# Altium project Sub Board Top.PrjPcb
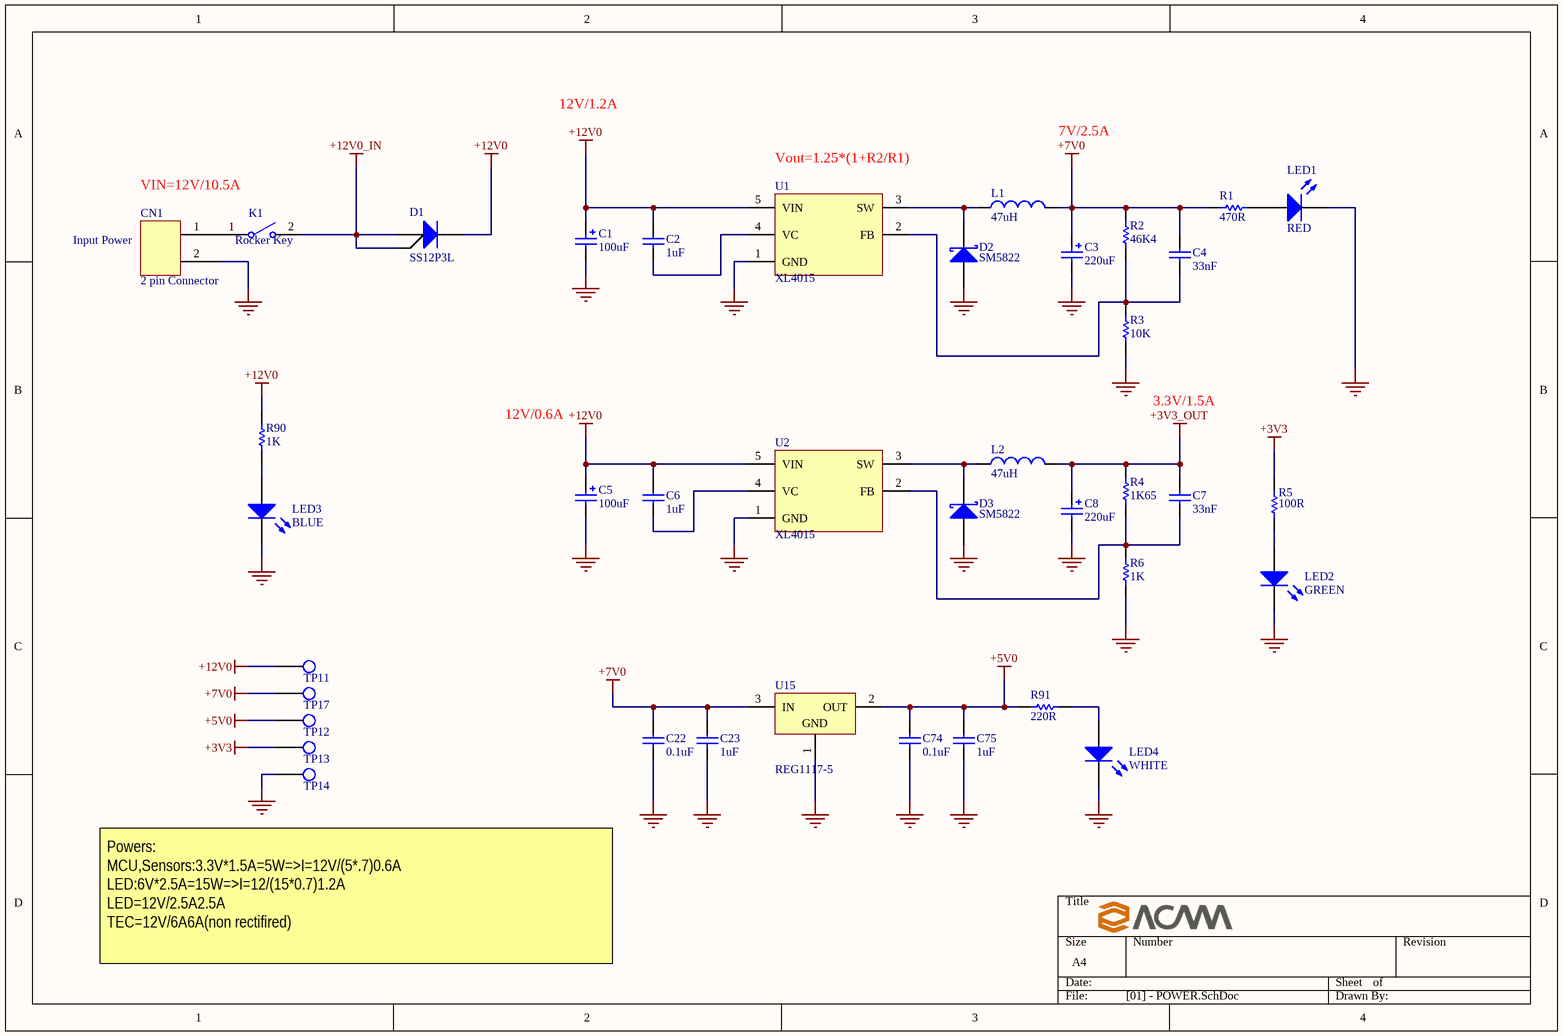
[diagram p0: [01] - POWER.SchDoc]
7 sheets, 117 parts. Net scope: flat (ports and power ports of the same name join across sheets).
Board file: Top Board_PCB.PcbDoc
Sheets:
  [01] - POWER.SchDoc
  [03] - RS232, JOYSTICK.SchDoc
  [06] - TEMP, HUM, CUR SENSORS.SchDoc
  [07] - TEMP, PROXIMITY SENSORS.SchDoc
  [08] - LUX, LED_BOARD CONN.SchDoc
  [09] - DISPLAY.SchDoc
  [13] - TOP BOARD HEADER.SchDoc

## Sheet [01] - POWER.SchDoc
size A4; DocumentNumber: 1; SheetNumber: 1; SheetTotal: 14

### Parts
C1  100uF  [WCAP-ASLI_6.3x5.5]
C2  1uF  [0805_C_AUTO]
C3  220uF  [WCAP-ASLI_6.3x5.5]
C4  33nF  [0805_C_AUTO]
C5  100uF  [WCAP-ASLI_6.3x5.5]
C6  1uF  [0805_C_AUTO]
C7  33nF  [0805_C_AUTO]
C8  220uF  [WCAP-ASLI_6.3x5.5]
C22  0.1uF  [0805_C_AUTO]
C23  1uF  [0805_C_AUTO]
C74  0.1uF  [0805_C_AUTO]
C75  1uF  [0805_C_AUTO]
CN1  2 pin Connector  [KF142R_CONN_2PIN]
D1  SS12P3L  [TO-277A]
D2  SM5822  [DO-214AB]
D3  SM5822  [DO-214AB]
K1  Rocker Key  [MR-1-116]
L1  47uH  [INDUCTOR_12x12]
L2  47uH  [INDUCTOR_12x12]
LED1  RED  [LED_1206]
LED2  GREEN  [LED_1206]
LED3  BLUE  [LED_1206]
LED4  WHITE  [LED_1206]
R1  470R  [0805_R_AUTO]
R2  46K4  [0805_R_AUTO]
R3  10K  [0805_R_AUTO]
R4  1K65  [0805_R_AUTO]
R5  100R  [0805_R_AUTO]
R6  1K  [0805_R_AUTO]
R90  1K  [0805_R_AUTO]
R91  220R  [0805_R_AUTO]
TP11  Test Point  [PIN_2mm]  (value not drawn)
TP12  Test Point  [PIN_2mm]  (value not drawn)
TP13  Test Point  [PIN_2mm]  (value not drawn)
TP14  Test Point  [PIN_2mm]  (value not drawn)
TP17  Test Point  [PIN_2mm]  (value not drawn)
U1  XL4015  [TO-263-5]
U2  XL4015  [TO-263-5]
U15  REG1117-5  [SOT-223]

### Nets
+3V3: R5.1 TP13.1
+3V3_OUT: C7.2 C8.1 L2.2 R4.2
+5V0: C74.2 C75.2 R91.1 TP12.1 U15.2(OUT)
+7V0: C3.1 C4.2 C22.2 C23.2 L1.2 R1.2 R2.2 TP17.1 U15.3(IN)
+12V0: C1.1 C2.2 C5.1 C6.2 D1.3(K) R90.2 TP11.1 U1.5(VIN) U2.5(VIN)
+12V0_IN: D1.1(A1) D1.2(A2) K1.2(NO)
GND: C1.2 C3.2 C5.2 C8.2 C22.1 C23.1 C74.1 C75.1 CN1.2 D2.1(A) D3.1(A) LED1.2(K) LED2.2(K) LED3.2(K) LED4.2(K) R3.1 R6.1 TP14.1 U1.1(GND) U2.1(GND) U15.1(GND)
NetC2_1: C2.1 U1.4(VC)
NetC4_1: C4.1 R2.1 R3.2 U1.2(FB)
NetC6_1: C6.1 U2.4(VC)
NetC7_1: C7.1 R4.1 R6.2 U2.2(FB)
NetCN1_1: CN1.1 K1.1(COMMON)
NetD2_2: D2.2(K) L1.1 U1.3(SW)
NetD3_2: D3.2(K) L2.1 U2.3(SW)
NetLED1_1: LED1.1(A) R1.1
NetLED2_1: LED2.1(A) R5.2
NetLED3_1: LED3.1(A) R90.1
NetLED4_1: LED4.1(A) R91.2

### Notes on the sheet
- 12V/1.2A
- (near U1) Vout=1.25*(1+R2/R1)
- 7V/2.5A
- (near CN1) Input Power
- VIN=12V/10.5A
- 12V/0.6A
- 3.3V/1.5A
- Powers:
  MCU,Sensors:3.3V*1.5A=5W=>I=12V/(5*.7)0.6A
  LED:6V*2.5A=15W=>I=12/(15*0.7)1.2A
  LED=12V/2.5A2.5A
  TEC=12V/6A6A(non rectifired)

### Library data of the parts
C1 C5 = Cap Aluminium Electrolytic: Aluminium Electrolytic Capacitor; RATED_VOLTAGE: 25V; Value: 100uF; Manufacturer Part Num: *
C2 C6 C23 C75 = Cap SMD: Non-Pol SMD Capacitor; RATED_VOLTAGE: 25V; Value: 1uF; Manufacturer Part Num: *
C3 C8 = Cap Aluminium Electrolytic: Aluminium Electrolytic Capacitor; RATED_VOLTAGE: 16V; Value: 220uF; Manufacturer Part Num: *
C4 C7 C22 C74 = Cap SMD: Non-Pol SMD Capacitor; RATED_VOLTAGE: 16V; Manufacturer Part Num: *
  C4 C7: Value: 33nF
  C22 C74: Value: 0.1uF; Dielectric: *
CN1 = Connector Screwless 2 pin: KAIFENG Screwless Connector 2 pin; Manufacturer Part Num: KF142R; Value: 2 pin Connector
D1 = Diode dual: High Current Density Surface Mount Schottky Barrier Rectifiers; Manufacturer Part Num: SS12P3LHM3_A/H; Value: SS12P3L
D2 D3 = Diode Schottky: Schottky Diode; Value: SM5822
K1 = Rocker Key: Manufacturer Part Num: MR-1-116-C5N-BB; Value: Rocker Key
L1 L2 = Inductor: Inductor SMD; Manufacturer Part Num: MSS1210-473MED; Value: 47uH
LED1-LED4 = LED: Typical LED
  LED1: Value: RED
  LED2: Value: GREEN
  LED3: Value: BLUE
  LED4: Value: WHITE
R1-R4 R6 = Res SMD: SMD Resistor; Tolerance: 1%; Manufacturer Part Num: *
  R1: Value: 470R
  R2: Value: 46K4
  R3: Value: 10K
  R4: Value: 1K65
  R6: Value: 1K
R5 R90 R91 = Res SMD: SMD Resistor; Tolerance: 5%; Manufacturer Part Num: *
  R5: Value: 100R
  R90: Value: 1K
  R91: Value: 220R
TP11-TP14 TP17 = Test Point: Test Point Footprint; Value: Test Point
U15 = REG1117: 3-Terminal Positive Fixed Voltage Regulator; Value: REG1117-5
U1 U2 = XL4015: Value: XL4015

## Sheet [03] - RS232, JOYSTICK.SchDoc
size A4; DocumentNumber: 3; SheetNumber: 3; SheetTotal: 14
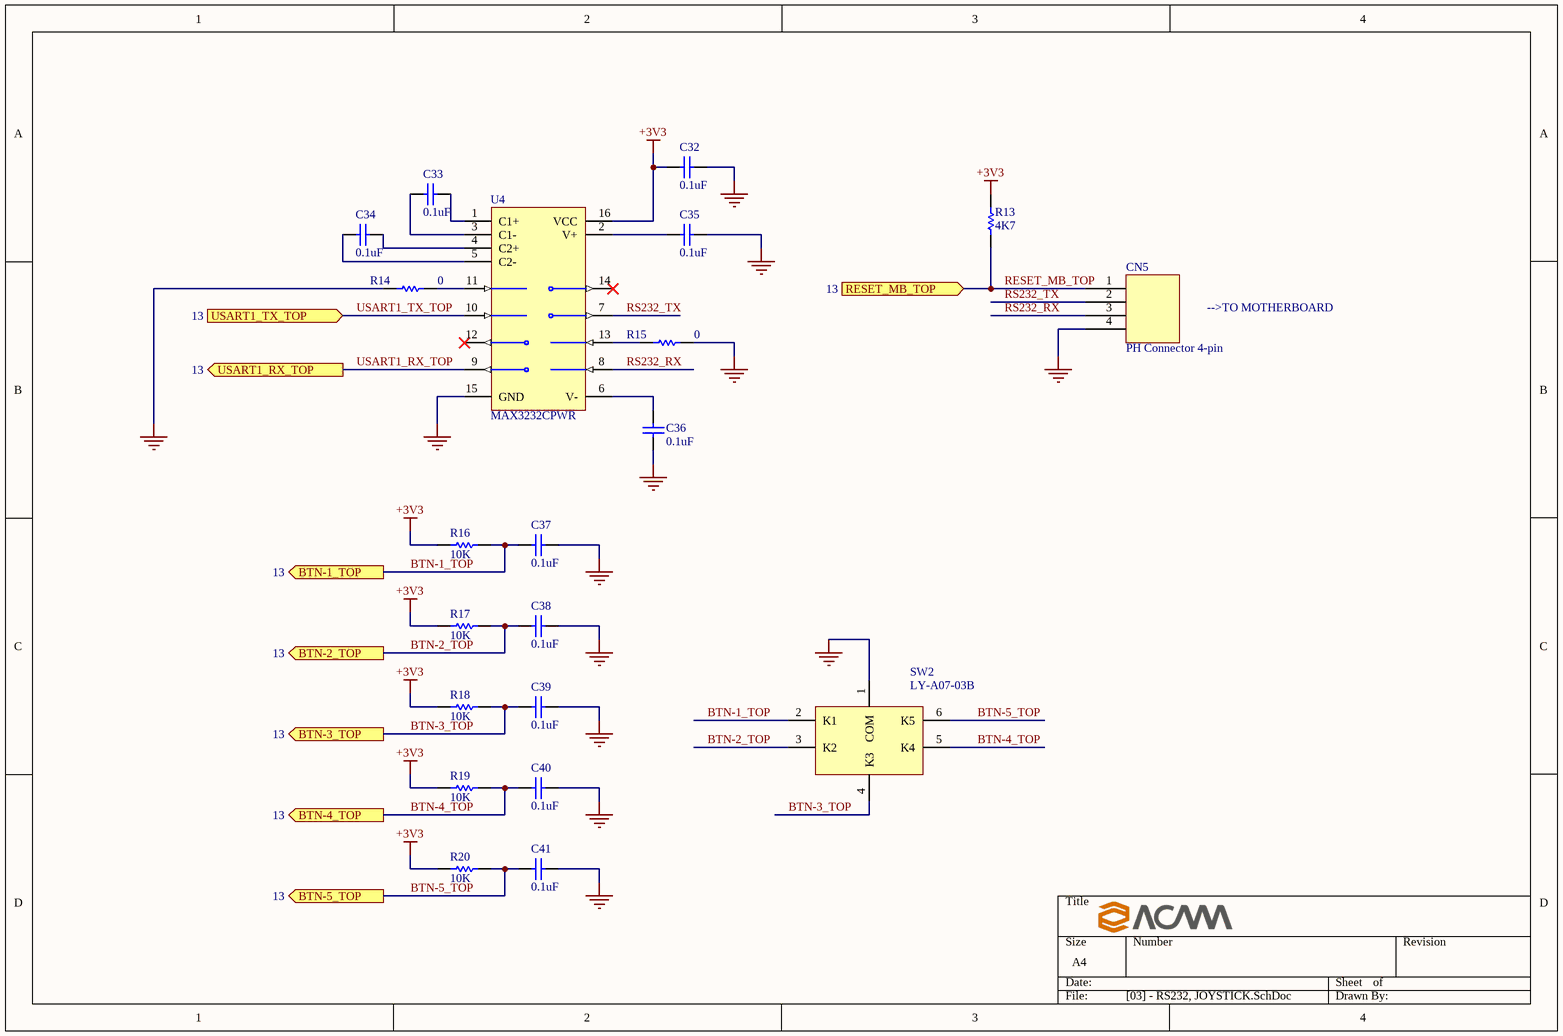
[diagram p1: [03] - RS232, JOYSTICK.SchDoc]

### Parts
C32  0.1uF  [0805_C_AUTO]
C33  0.1uF  [0805_C_AUTO]
C34  0.1uF  [0805_C_AUTO]
C35  0.1uF  [0805_C_AUTO]
C36  0.1uF  [0805_C_AUTO]
C37  0.1uF  [0805_C_AUTO]
C38  0.1uF  [0805_C_AUTO]
C39  0.1uF  [0805_C_AUTO]
C40  0.1uF  [0805_C_AUTO]
C41  0.1uF  [0805_C_AUTO]
CN5  PH Connector 4-pin  [PH_4PIN]
R13  4K7  [0805_R_AUTO]
R14  0  [0805_R_AUTO]
R15  0  [0805_R_AUTO]
R16  10K  [0805_R_AUTO]
R17  10K  [0805_R_AUTO]
R18  10K  [0805_R_AUTO]
R19  10K  [0805_R_AUTO]
R20  10K  [0805_R_AUTO]
SW2  LY-A07-03B  [LY-A07-03B]
U4  MAX3232CPWR  [TSSOP-16]

### Ports
BTN-1_TOP (out, see 13), BTN-2_TOP (out, see 13), BTN-3_TOP (out, see 13), BTN-4_TOP (out, see 13), BTN-5_TOP (out, see 13), RESET_MB_TOP (in, see 13), USART1_RX_TOP (out, see 13), USART1_TX_TOP (in, see 13)

### Nets
+3V3: C32.2 R13.1 R16.2 R17.2 R18.2 R19.2 R20.2 U4.16(VCC)
GND: C32.1 C35.1 C36.1 C37.1 C38.1 C39.1 C40.1 C41.1 CN5.4 R14.1 R15.2 SW2.1(COM) U4.15(GND)
BTN-1_TOP: C37.2 R16.1 SW2.2(K1) ; port BTN-1_TOP
BTN-2_TOP: C38.2 R17.1 SW2.3(K2) ; port BTN-2_TOP
BTN-3_TOP: C39.2 R18.1 SW2.4(K3) ; port BTN-3_TOP
BTN-4_TOP: C40.2 R19.1 SW2.5(K4) ; port BTN-4_TOP
BTN-5_TOP: C41.2 R20.1 SW2.6(K5) ; port BTN-5_TOP
RESET_MB_TOP: CN5.1 R13.2 ; port RESET_MB_TOP
RS232_RX: CN5.3 U4.8(R2IN)
RS232_TX: CN5.2 U4.7(T2OUT)
USART1_RX_TOP: U4.9(R2OUT) ; port USART1_RX_TOP
USART1_TX_TOP: U4.10(T2IN) ; port USART1_TX_TOP
NetC33_1: C33.1 U4.3(C1-)
NetC33_2: C33.2 U4.1(C1+)
NetC34_1: C34.1 U4.4(C2+)
NetC34_2: C34.2 U4.5(C2-)
NetC35_2: C35.2 U4.2(V+)
NetC36_2: C36.2 U4.6(V-)
NetR14_2: R14.2 U4.11(T1IN)
NetR15_1: R15.1 U4.13(R1IN)

Not connected (* = marked no-connect by the designer): U4 12(R1OUT)* 14(T1OUT)*

### Notes on the sheet
- -->TO MOTHERBOARD

### Library data of the parts
C32-C41 = Cap SMD: as C4 on sheet [01] - POWER; Value: 0.1uF; Manufacturer Part Num: *
CN5 = PH Connector 4-pin: PH Connector , 4 pin, 2mm pitch, straight; Value: PH Connector 4-pin
R13-R20 = Res SMD: SMD Resistor; Tolerance: 5%; Manufacturer Part Num: *
  R13: Value: 4K7
  R14 R15: Value: 0
  R16-R20: Value: 10K
SW2 = KEY 5W: 5 Way Key; Value: LY-A07-03B
U4 = MAX3232: 3.0V TO 5.5V, Low-Power, up to 1Mbps, True RS-232 Transceiver Using Four 0.1µF External Capacitor; Value: MAX3232CPWR

## Sheet [06] - TEMP, HUM, CUR SENSORS.SchDoc
size A3; DocumentNumber: 6; SheetNumber: 6; SheetTotal: 14
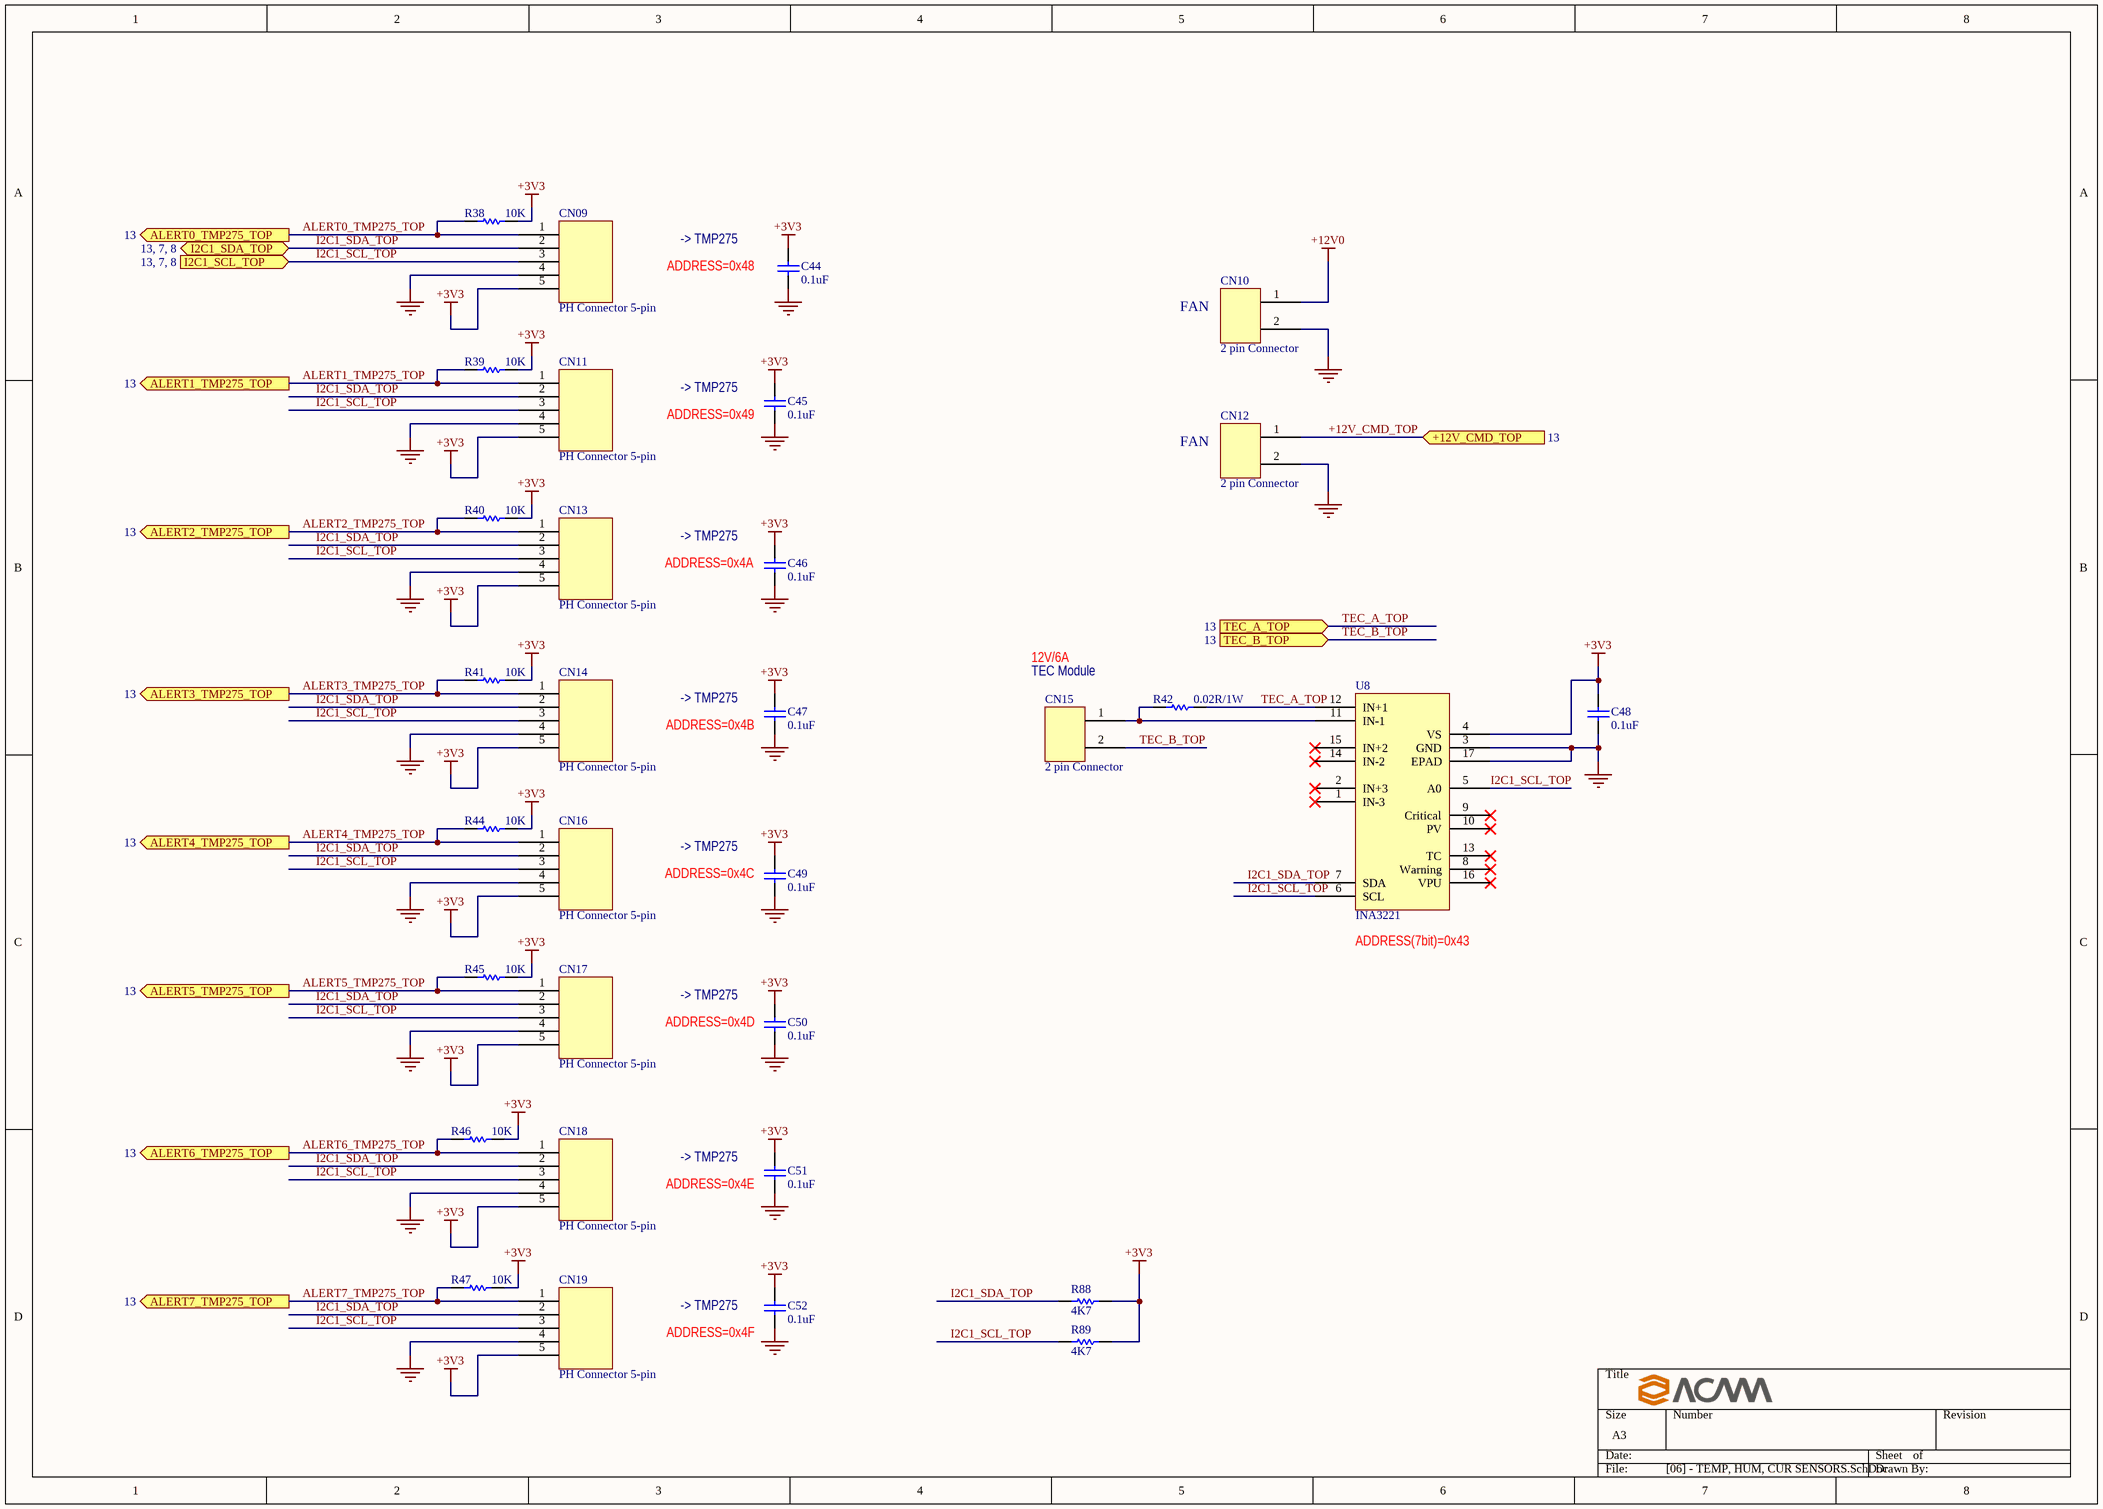
[diagram p2: [06] - TEMP, HUM, CUR SENSORS.SchDoc]

### Parts
C44  0.1uF  [0805_C_AUTO]
C45  0.1uF  [0805_C_AUTO]
C46  0.1uF  [0805_C_AUTO]
C47  0.1uF  [0805_C_AUTO]
C48  0.1uF  [0805_C_AUTO]
C49  0.1uF  [0805_C_AUTO]
C50  0.1uF  [0805_C_AUTO]
C51  0.1uF  [0805_C_AUTO]
C52  0.1uF  [0805_C_AUTO]
CN09  PH Connector 5-pin  [PH_5PIN]
CN10  2 pin Connector  [KF142R_CONN_2PIN]
CN11  PH Connector 5-pin  [PH_5PIN]
CN12  2 pin Connector  [KF142R_CONN_2PIN]
CN13  PH Connector 5-pin  [PH_5PIN]
CN14  PH Connector 5-pin  [PH_5PIN]
CN15  2 pin Connector  [KF142R_CONN_2PIN]
CN16  PH Connector 5-pin  [PH_5PIN]
CN17  PH Connector 5-pin  [PH_5PIN]
CN18  PH Connector 5-pin  [PH_5PIN]
CN19  PH Connector 5-pin  [PH_5PIN]
R38  10K  [0805_R_AUTO]
R39  10K  [0805_R_AUTO]
R40  10K  [0805_R_AUTO]
R41  10K  [0805_R_AUTO]
R42  0.02R/1W  [2512_R]
R44  10K  [0805_R_AUTO]
R45  10K  [0805_R_AUTO]
R46  10K  [0805_R_AUTO]
R47  10K  [0805_R_AUTO]
R88  4K7  [0805_R_AUTO]
R89  4K7  [0805_R_AUTO]
U8  INA3221  [QFN-16]

### Ports
+12V_CMD_TOP (in, see 13), ALERT0_TMP275_TOP (out, see 13), ALERT1_TMP275_TOP (out, see 13), ALERT2_TMP275_TOP (out, see 13), ALERT3_TMP275_TOP (out, see 13), ALERT4_TMP275_TOP (out, see 13), ALERT5_TMP275_TOP (out, see 13), ALERT6_TMP275_TOP (out, see 13), ALERT7_TMP275_TOP (out, see 13), I2C1_SCL_TOP (in, see 13, 7, 8), I2C1_SDA_TOP (bidir, see 13, 7, 8), TEC_A_TOP (in, see 13), TEC_B_TOP (in, see 13)

### Nets
+3V3: C44.2 C45.2 C46.2 C47.2 C48.2 C49.2 C50.2 C51.2 C52.2 CN09.5 CN11.5 CN13.5 CN14.5 CN16.5 CN17.5 CN18.5 CN19.5 R38.1 R39.1 R40.1 R41.1 R44.1 R45.1 R46.1 R47.1 R88.2 R89.2 U8.4(VS)
+12V0: CN10.1
GND: C44.1 C45.1 C46.1 C47.1 C48.1 C49.1 C50.1 C51.1 C52.1 CN09.4 CN10.2 CN11.4 CN12.2 CN13.4 CN14.4 CN16.4 CN17.4 CN18.4 CN19.4 U8.3(GND) U8.17(EPAD)
+12V_CMD_TOP: CN12.1 ; port +12V_CMD_TOP
ALERT0_TMP275_TOP: CN09.1 R38.2 ; port ALERT0_TMP275_TOP
ALERT1_TMP275_TOP: CN11.1 R39.2 ; port ALERT1_TMP275_TOP
ALERT2_TMP275_TOP: CN13.1 R40.2 ; port ALERT2_TMP275_TOP
ALERT3_TMP275_TOP: CN14.1 R41.2 ; port ALERT3_TMP275_TOP
ALERT4_TMP275_TOP: CN16.1 R44.2 ; port ALERT4_TMP275_TOP
ALERT5_TMP275_TOP: CN17.1 R45.2 ; port ALERT5_TMP275_TOP
ALERT6_TMP275_TOP: CN18.1 R46.2 ; port ALERT6_TMP275_TOP
ALERT7_TMP275_TOP: CN19.1 R47.2 ; port ALERT7_TMP275_TOP
I2C1_SCL_TOP: CN09.3 CN11.3 CN13.3 CN14.3 CN16.3 CN17.3 CN18.3 CN19.3 R89.1 U8.5(A0) U8.6(SCL) ; port I2C1_SCL_TOP
I2C1_SDA_TOP: CN09.2 CN11.2 CN13.2 CN14.2 CN16.2 CN17.2 CN18.2 CN19.2 R88.1 U8.7(SDA) ; port I2C1_SDA_TOP
TEC_A_TOP: R42.2 U8.12(IN+1) ; port TEC_A_TOP
TEC_B_TOP: CN15.2 ; port TEC_B_TOP
NetCN15_1: CN15.1 R42.1 U8.11(IN-1)

Not connected (* = marked no-connect by the designer): U8 1(IN-3)* 2(IN+3)* 8(Warning)* 9(Critical)* 10(PV)* 13(TC)* 14(IN-2)* 15(IN+2)* 16(VPU)*

### Notes on the sheet
- (near C44) -> TMP275
- (near C44) ADDRESS=0x48
- FAN
- (near C45) ADDRESS=0x49
- (near C45) -> TMP275
- (near C46) ADDRESS=0x4A
- (near C46) -> TMP275
- (near C47) -> TMP275
- (near CN15) TEC Module
- 12V/6A
- (near C47) ADDRESS=0x4B
- (near C49) -> TMP275
- (near C49) ADDRESS=0x4C
- (near U8) ADDRESS(7bit)=0x43
- (near C50) ADDRESS=0x4D
- (near C50) -> TMP275
- (near C51) ADDRESS=0x4E
- (near C51) -> TMP275
- (near C52) -> TMP275
- (near C52) ADDRESS=0x4F

### Library data of the parts
C44-C52 = Cap SMD: as C4 on sheet [01] - POWER; Value: 0.1uF; Manufacturer Part Num: *
CN09 CN11 CN13 CN14 CN16-CN19 = PH Connector 5-pin: PH Connector , 5 pin, 2mm pitch, straight; Value: PH Connector 5-pin
CN10 CN12 CN15 = Connector Screwless 2 pin: as CN1 on sheet [01] - POWER; Value: 2 pin Connector
R38-R41 R44-R47 R88 R89 = Res SMD: SMD Resistor; Tolerance: 5%; Manufacturer Part Num: *
  R38-R41 R44-R47: Value: 10K
  R88 R89: Value: 4K7
R42 = Res SMD: SMD Resistor; Manufacturer Part Num: RL2512FK-070R02L; Tolerance: 1%; Value: 0.02R/1W
U8 = INA3221: INA3221 Triple-Channel, High-Side Measurement, / Shunt and Bus Voltage Monitor with I2C- and SMBUS-Compatible Interface; Manufacturer Part Num: INA3221AIRGVR; Value: INA3221

## Sheet [07] - TEMP, PROXIMITY SENSORS.SchDoc
size A4; DocumentNumber: 7; SheetNumber: 7; SheetTotal: 14
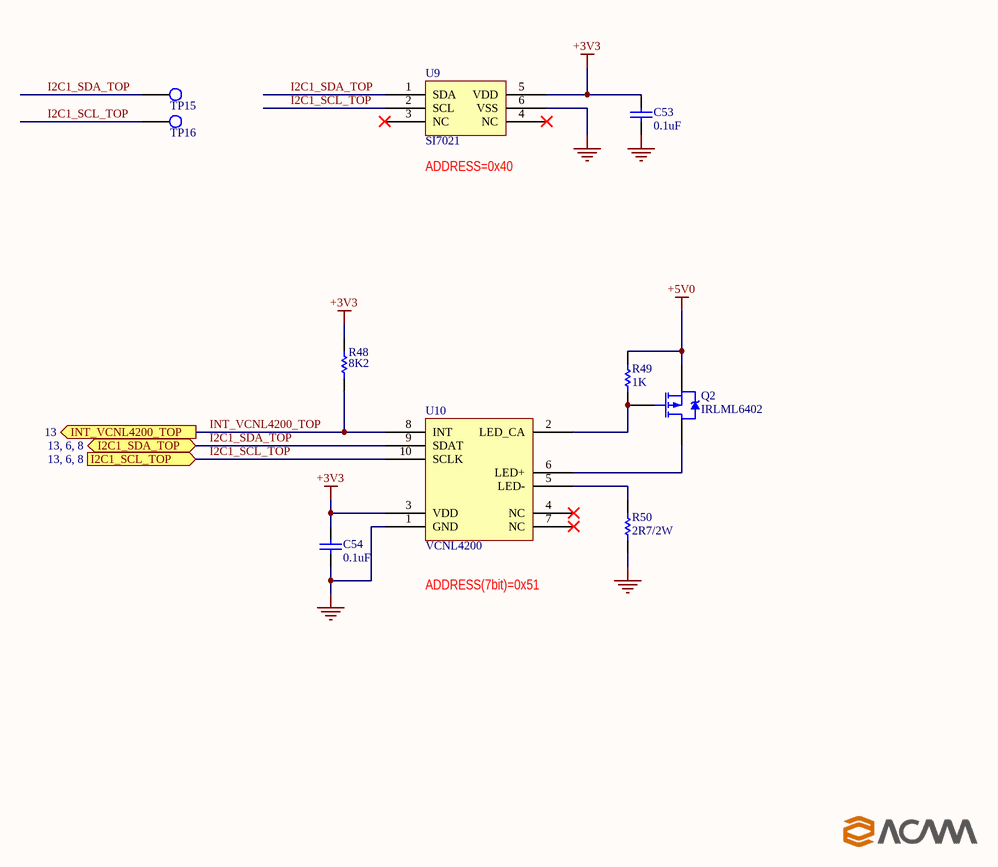
[diagram p3: [07] - TEMP, PROXIMITY SENSORS.SchDoc]

### Parts
C53  0.1uF  [0805_C_AUTO]
C54  0.1uF  [0805_C_AUTO]
Q2  IRLML6402  [SOT23]
R48  8K2  [0805_R_AUTO]
R49  1K  [0805_R_AUTO]
R50  2R7/2W  [2512_R]
TP15  Test Point  [PIN_1mm]  (value not drawn)
TP16  Test Point  [PIN_1mm]  (value not drawn)
U9  SI7021  [DFN-6]
U10  VCNL4200  [VCNL4200]

### Ports
I2C1_SCL_TOP (in, see 13, 6, 8), I2C1_SDA_TOP (bidir, see 13, 6, 8), INT_VCNL4200_TOP (out, see 13)

### Nets
+3V3: C53.2 C54.2 R48.1 U9.5(VDD) U10.3(VDD)
+5V0: Q2.2(S) R49.2
GND: C53.1 C54.1 R50.1 U9.6(VSS) U10.1(GND)
I2C1_SCL_TOP: TP16.1 U9.2(SCL) U10.10(SCLK) ; port I2C1_SCL_TOP
I2C1_SDA_TOP: TP15.1 U9.1(SDA) U10.9(SDAT) ; port I2C1_SDA_TOP
INT_VCNL4200_TOP: R48.2 U10.8(INT) ; port INT_VCNL4200_TOP
NetQ2_1: Q2.1(G) R49.1 U10.2(LED_CA)
NetQ2_3: Q2.3(D) U10.6(LED+)
NetR50_2: R50.2 U10.5(LED-)

Not connected (* = marked no-connect by the designer): U9 3(NC)* 4(NC)*; U10 4(NC)* 7(NC)*

### Notes on the sheet
- (near U9) ADDRESS=0x40
- ADDRESS(7bit)=0x51

### Library data of the parts
C53 C54 = Cap SMD: as C4 on sheet [01] - POWER; Value: 0.1uF; Manufacturer Part Num: *
Q2 = MOSFET P-CH: P-Channel Mosfet; Manufacturer Part Num: IRLML6402TRPBF; Value: IRLML6402
R48 R49 = Res SMD: SMD Resistor; Tolerance: 5%; Manufacturer Part Num: *
  R48: Value: 8K2
  R49: Value: 1K
R50 = Res SMD: SMD Resistor; Manufacturer Part Num: AC2512JK-7W2R7L; Tolerance: 5%; Value: 2R7/2W
TP15 TP16 = Test Point: Test Point Footprint; Value: Test Point
U9 = SI7021: I2C HUMIDITY AND TEMPERATURE SENSOR; Value: SI7021
U10 = VCNL4200: High Sensitivity Long Distance Proximity and Ambient Light Sensor With I2C Interface; Value: VCNL4200

## Sheet [08] - LUX, LED_BOARD CONN.SchDoc
size A4; DocumentNumber: 8; SheetNumber: 8; SheetTotal: 14
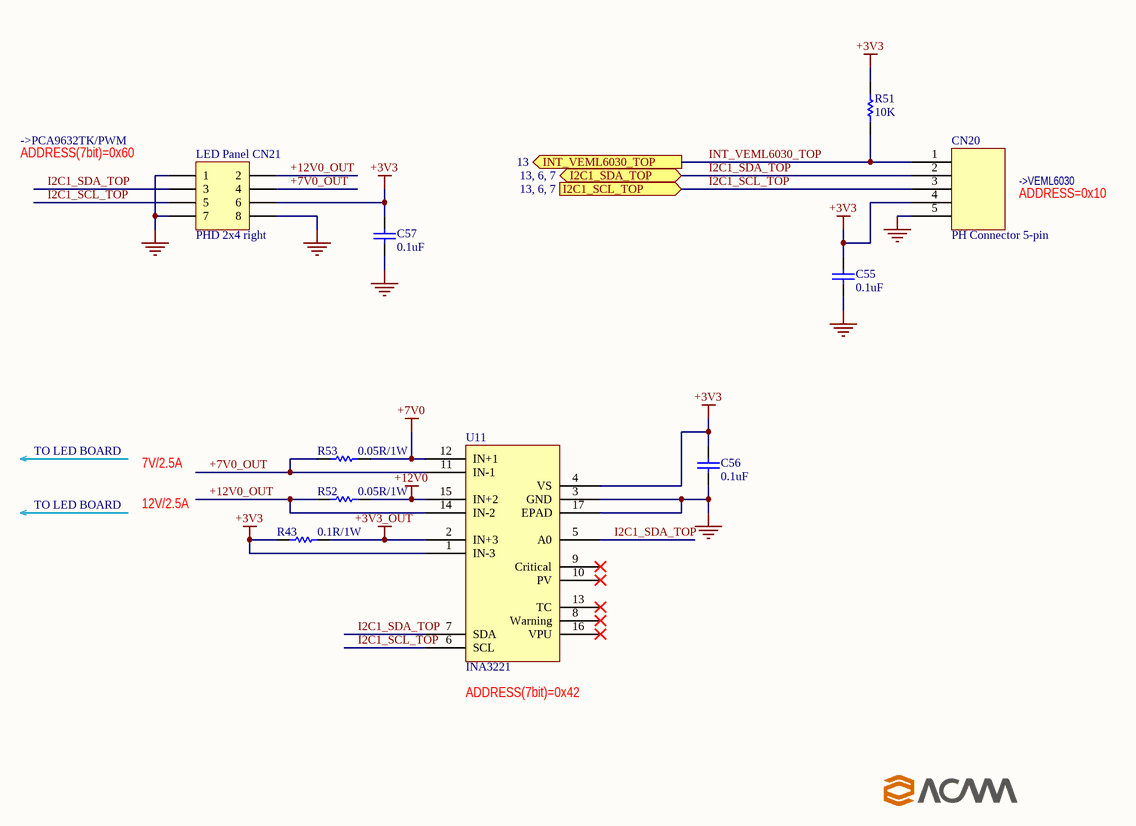
[diagram p4: [08] - LUX, LED_BOARD CONN.SchDoc]

### Parts
C55  0.1uF  [0805_C_AUTO]
C56  0.1uF  [0805_C_AUTO]
C57  0.1uF  [0805_C_AUTO]
CN20  PH Connector 5-pin  [PH_5PIN]
LED_Panel_CN21  PHD 2x4 right  [PHDR_8PIN]
R43  0.1R/1W  [2512_R]
R51  10K  [0805_R_AUTO]
R52  0.05R/1W  [2512_R]
R53  0.05R/1W  [2512_R]
U11  INA3221  [QFN-16]

### Ports
I2C1_SCL_TOP (in, see 13, 6, 7), I2C1_SDA_TOP (bidir, see 13, 6, 7), INT_VEML6030_TOP (out, see 13)

### Nets
+3V3: C55.2 C56.2 C57.2 CN20.4 LED_Panel_CN21.6 R43.1 R51.1 U11.1(IN-3) U11.4(VS)
+3V3_OUT: R43.2 U11.2(IN+3)
+7V0: R53.2 U11.12(IN+1)
+12V0: R52.2 U11.15(IN+2)
GND: C55.1 C56.1 C57.1 CN20.5 LED_Panel_CN21.1 LED_Panel_CN21.7 LED_Panel_CN21.8 U11.3(GND) U11.17(EPAD)
+7V0_OUT: LED_Panel_CN21.4 R53.1 U11.11(IN-1)
+12V0_OUT: LED_Panel_CN21.2 R52.1 U11.14(IN-2)
I2C1_SCL_TOP: CN20.3 LED_Panel_CN21.5 U11.6(SCL) ; port I2C1_SCL_TOP
I2C1_SDA_TOP: CN20.2 LED_Panel_CN21.3 U11.5(A0) U11.7(SDA) ; port I2C1_SDA_TOP
INT_VEML6030_TOP: CN20.1 R51.2 ; port INT_VEML6030_TOP

Not connected (* = marked no-connect by the designer): U11 8(Warning)* 9(Critical)* 10(PV)* 13(TC)* 16(VPU)*

### Notes on the sheet
- (near LED_Panel_CN21) ADDRESS(7bit)=0x60
- ->PCA9632TK/PWM
- ->VEML6030
- ADDRESS=0x10
- TO LED BOARD
- 12V/2.5A
- 7V/2.5A
- (near U11) ADDRESS(7bit)=0x42

### Library data of the parts
C55-C57 = Cap SMD: as C4 on sheet [01] - POWER; Value: 0.1uF; Manufacturer Part Num: *
CN20 = PH Connector 5-pin: as CN09 on sheet [06] - TEMP, HUM, CUR SENSORS; Value: PH Connector 5-pin
LED_Panel_CN21 = PHD Connector 2x4 Right: S8B-PHDSS, PH Double Right 2x4; Value: PHD 2x4 right
R43 = Res SMD: SMD Resistor; Manufacturer Part Num: RL2512FK-070R1L; Tolerance: 1%; Value: 0.1R/1W
R51 = Res SMD: SMD Resistor; Tolerance: 5%; Value: 10K; Manufacturer Part Num: *
R52 R53 = Res SMD: SMD Resistor; Manufacturer Part Num: RL2512FK-070R05L; Tolerance: 1%; Value: 0.05R/1W
U11 = INA3221: as U8 on sheet [06] - TEMP, HUM, CUR SENSORS; Value: INA3221

## Sheet [09] - DISPLAY.SchDoc
size A4; DocumentNumber: 9; SheetNumber: 9; SheetTotal: 14
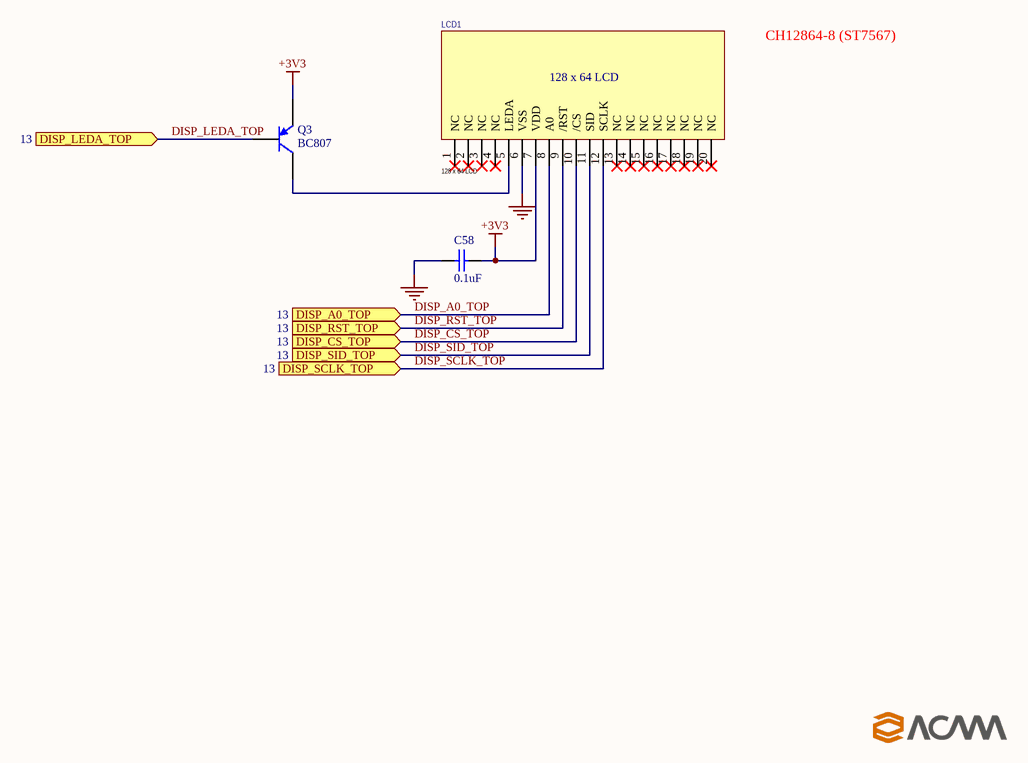
[diagram p5: [09] - DISPLAY.SchDoc]

### Parts
C58  0.1uF  [0805_C_AUTO]
LCD1  128 x 64 LCD  [LCD_128x64]
Q3  BC807  [SOT23]

### Ports
DISP_A0_TOP (in, see 13), DISP_CS_TOP (in, see 13), DISP_LEDA_TOP (in, see 13), DISP_RST_TOP (in, see 13), DISP_SCLK_TOP (in, see 13), DISP_SID_TOP (in, see 13)

### Nets
+3V3: C58.1 LCD1.7(VDD) Q3.2(E)
GND: C58.2 LCD1.6(VSS)
DISP_A0_TOP: LCD1.8(A0) ; port DISP_A0_TOP
DISP_CS_TOP: LCD1.10(/CS) ; port DISP_CS_TOP
DISP_LEDA_TOP: Q3.1(B) ; port DISP_LEDA_TOP
DISP_RST_TOP: LCD1.9(/RST) ; port DISP_RST_TOP
DISP_SCLK_TOP: LCD1.12(SCLK) ; port DISP_SCLK_TOP
DISP_SID_TOP: LCD1.11(SID) ; port DISP_SID_TOP
NetLCD1_5: LCD1.5(LEDA) Q3.3(C)

Not connected (* = marked no-connect by the designer): LCD1 1(NC)* 2(NC)* 3(NC)* 4(NC)* 13(NC)* 14(NC)* 15(NC)* 16(NC)* 17(NC)* 18(NC)* 19(NC)* 20(NC)*

### Notes on the sheet
- CH12864-8 (ST7567)

### Library data of the parts
C58 = Cap SMD: as C4 on sheet [01] - POWER; Value: 0.1uF; Manufacturer Part Num: *
LCD1 = LCD 128x64: Chiness 128 x 64 LCD; Value: 128 x 64 LCD
Q3 = Transistor PNP: PNP General Purpose Transistor; Value: BC807

## Sheet [13] - TOP BOARD HEADER.SchDoc
size A4; DocumentNumber: 13; SheetNumber: 13; SheetTotal: 14
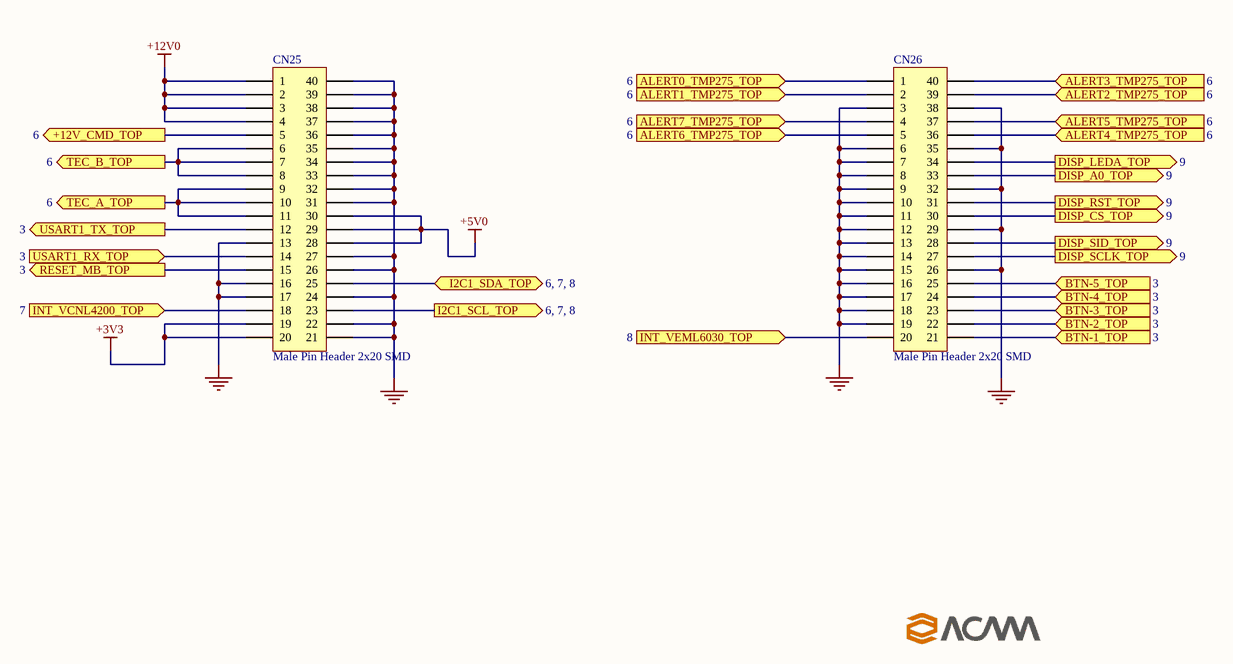
[diagram p6: [13] - TOP BOARD HEADER.SchDoc]

### Parts
CN25  Male Pin Header 2x20 SMD  [HEADER_2x20_SMD]
CN26  Male Pin Header 2x20 SMD  [HEADER_2x20_SMD]

### Ports
+12V_CMD_TOP (out, see 6), ALERT0_TMP275_TOP (in, see 6), ALERT1_TMP275_TOP (in, see 6), ALERT2_TMP275_TOP (in, see 6), ALERT3_TMP275_TOP (in, see 6), ALERT4_TMP275_TOP (in, see 6), ALERT5_TMP275_TOP (in, see 6), ALERT6_TMP275_TOP (in, see 6), ALERT7_TMP275_TOP (in, see 6), BTN-1_TOP (in, see 3), BTN-2_TOP (in, see 3), BTN-3_TOP (in, see 3), BTN-4_TOP (in, see 3), BTN-5_TOP (in, see 3), DISP_A0_TOP (out, see 9), DISP_CS_TOP (out, see 9), DISP_LEDA_TOP (out, see 9), DISP_RST_TOP (out, see 9), DISP_SCLK_TOP (out, see 9), DISP_SID_TOP (out, see 9), I2C1_SCL_TOP (out, see 6, 7, 8), I2C1_SDA_TOP (bidir, see 6, 7, 8), INT_VCNL4200_TOP (in, see 7), INT_VEML6030_TOP (in, see 8), RESET_MB_TOP (out, see 3), TEC_A_TOP (out, see 6), TEC_B_TOP (out, see 6), USART1_RX_TOP (in, see 3), USART1_TX_TOP (out, see 3)

### Nets
+3V3: CN25.19 CN25.20
+5V0: CN25.28 CN25.29 CN25.30
+12V0: CN25.1 CN25.2 CN25.3 CN25.4
GND: CN25.13 CN25.16 CN25.17 CN25.21 CN25.22 CN25.24 CN25.26 CN25.27 CN25.31 CN25.32 CN25.33 CN25.34 CN25.35 CN25.36 CN25.37 CN25.38 CN25.39 CN25.40 CN26.3 CN26.6 CN26.7 CN26.8 CN26.9 CN26.10 CN26.11 CN26.12 CN26.13 CN26.14 CN26.15 CN26.16 CN26.17 CN26.18 CN26.19 CN26.26 CN26.29 CN26.32 CN26.35 CN26.38
+12V_CMD_TOP: CN25.5 ; port +12V_CMD_TOP
ALERT0_TMP275_TOP: CN26.1 ; port ALERT0_TMP275_TOP
ALERT1_TMP275_TOP: CN26.2 ; port ALERT1_TMP275_TOP
ALERT2_TMP275_TOP: CN26.39 ; port ALERT2_TMP275_TOP
ALERT3_TMP275_TOP: CN26.40 ; port ALERT3_TMP275_TOP
ALERT4_TMP275_TOP: CN26.36 ; port ALERT4_TMP275_TOP
ALERT5_TMP275_TOP: CN26.37 ; port ALERT5_TMP275_TOP
ALERT6_TMP275_TOP: CN26.5 ; port ALERT6_TMP275_TOP
ALERT7_TMP275_TOP: CN26.4 ; port ALERT7_TMP275_TOP
BTN-1_TOP: CN26.21 ; port BTN-1_TOP
BTN-2_TOP: CN26.22 ; port BTN-2_TOP
BTN-3_TOP: CN26.23 ; port BTN-3_TOP
BTN-4_TOP: CN26.24 ; port BTN-4_TOP
BTN-5_TOP: CN26.25 ; port BTN-5_TOP
DISP_A0_TOP: CN26.33 ; port DISP_A0_TOP
DISP_CS_TOP: CN26.30 ; port DISP_CS_TOP
DISP_LEDA_TOP: CN26.34 ; port DISP_LEDA_TOP
DISP_RST_TOP: CN26.31 ; port DISP_RST_TOP
DISP_SCLK_TOP: CN26.27 ; port DISP_SCLK_TOP
DISP_SID_TOP: CN26.28 ; port DISP_SID_TOP
I2C1_SCL_TOP: CN25.23 ; port I2C1_SCL_TOP
I2C1_SDA_TOP: CN25.25 ; port I2C1_SDA_TOP
INT_VCNL4200_TOP: CN25.18 ; port INT_VCNL4200_TOP
INT_VEML6030_TOP: CN26.20 ; port INT_VEML6030_TOP
RESET_MB_TOP: CN25.15 ; port RESET_MB_TOP
TEC_A_TOP: CN25.9 CN25.10 CN25.11 ; port TEC_A_TOP
TEC_B_TOP: CN25.6 CN25.7 CN25.8 ; port TEC_B_TOP
USART1_RX_TOP: CN25.14 ; port USART1_RX_TOP
USART1_TX_TOP: CN25.12 ; port USART1_TX_TOP

### Library data of the parts
CN25 CN26 = Pin header Male 2x20 smd: SMD Male Pin Header 2.54mm Pitch, 2x20; System: Connector; Value: Male Pin Header 2x20 SMD

## Nets that join several sheets
+3V3: [01] - POWER (R5.1 TP13.1), [03] - RS232, JOYSTICK (8 pins), [06] - TEMP, HUM, CUR SENSORS (28 pins), [07] - TEMP, PROXIMITY SENSORS (5 pins), [08] - LUX, LED_BOARD CONN (9 pins), [09] - DISPLAY (C58.1 LCD1.7 Q3.2), [13] - TOP BOARD HEADER (CN25.19 CN25.20)
+3V3_OUT: [01] - POWER (C7.2 C8.1 L2.2 R4.2), [08] - LUX, LED_BOARD CONN (R43.2 U11.2)
+5V0: [01] - POWER (5 pins), [07] - TEMP, PROXIMITY SENSORS (Q2.2 R49.2), [13] - TOP BOARD HEADER (CN25.28 CN25.29 CN25.30)
+7V0: [01] - POWER (9 pins), [08] - LUX, LED_BOARD CONN (R53.2 U11.12)
+12V0: [01] - POWER (9 pins), [06] - TEMP, HUM, CUR SENSORS (CN10.1), [08] - LUX, LED_BOARD CONN (R52.2 U11.15), [13] - TOP BOARD HEADER (CN25.1 CN25.2 CN25.3 CN25.4)
GND: [01] - POWER (21 pins), [03] - RS232, JOYSTICK (13 pins), [06] - TEMP, HUM, CUR SENSORS (21 pins), [07] - TEMP, PROXIMITY SENSORS (5 pins), [08] - LUX, LED_BOARD CONN (9 pins), [09] - DISPLAY (C58.2 LCD1.6), [13] - TOP BOARD HEADER (38 pins)
+12V_CMD_TOP: [06] - TEMP, HUM, CUR SENSORS (CN12.1), [13] - TOP BOARD HEADER (CN25.5)
ALERT0_TMP275_TOP: [06] - TEMP, HUM, CUR SENSORS (CN09.1 R38.2), [13] - TOP BOARD HEADER (CN26.1)
ALERT1_TMP275_TOP: [06] - TEMP, HUM, CUR SENSORS (CN11.1 R39.2), [13] - TOP BOARD HEADER (CN26.2)
ALERT2_TMP275_TOP: [06] - TEMP, HUM, CUR SENSORS (CN13.1 R40.2), [13] - TOP BOARD HEADER (CN26.39)
ALERT3_TMP275_TOP: [06] - TEMP, HUM, CUR SENSORS (CN14.1 R41.2), [13] - TOP BOARD HEADER (CN26.40)
ALERT4_TMP275_TOP: [06] - TEMP, HUM, CUR SENSORS (CN16.1 R44.2), [13] - TOP BOARD HEADER (CN26.36)
ALERT5_TMP275_TOP: [06] - TEMP, HUM, CUR SENSORS (CN17.1 R45.2), [13] - TOP BOARD HEADER (CN26.37)
ALERT6_TMP275_TOP: [06] - TEMP, HUM, CUR SENSORS (CN18.1 R46.2), [13] - TOP BOARD HEADER (CN26.5)
ALERT7_TMP275_TOP: [06] - TEMP, HUM, CUR SENSORS (CN19.1 R47.2), [13] - TOP BOARD HEADER (CN26.4)
BTN-1_TOP: [03] - RS232, JOYSTICK (C37.2 R16.1 SW2.2), [13] - TOP BOARD HEADER (CN26.21)
BTN-2_TOP: [03] - RS232, JOYSTICK (C38.2 R17.1 SW2.3), [13] - TOP BOARD HEADER (CN26.22)
BTN-3_TOP: [03] - RS232, JOYSTICK (C39.2 R18.1 SW2.4), [13] - TOP BOARD HEADER (CN26.23)
BTN-4_TOP: [03] - RS232, JOYSTICK (C40.2 R19.1 SW2.5), [13] - TOP BOARD HEADER (CN26.24)
BTN-5_TOP: [03] - RS232, JOYSTICK (C41.2 R20.1 SW2.6), [13] - TOP BOARD HEADER (CN26.25)
DISP_A0_TOP: [09] - DISPLAY (LCD1.8), [13] - TOP BOARD HEADER (CN26.33)
DISP_CS_TOP: [09] - DISPLAY (LCD1.10), [13] - TOP BOARD HEADER (CN26.30)
DISP_LEDA_TOP: [09] - DISPLAY (Q3.1), [13] - TOP BOARD HEADER (CN26.34)
DISP_RST_TOP: [09] - DISPLAY (LCD1.9), [13] - TOP BOARD HEADER (CN26.31)
DISP_SCLK_TOP: [09] - DISPLAY (LCD1.12), [13] - TOP BOARD HEADER (CN26.27)
DISP_SID_TOP: [09] - DISPLAY (LCD1.11), [13] - TOP BOARD HEADER (CN26.28)
I2C1_SCL_TOP: [06] - TEMP, HUM, CUR SENSORS (11 pins), [07] - TEMP, PROXIMITY SENSORS (TP16.1 U9.2 U10.10), [08] - LUX, LED_BOARD CONN (CN20.3 LED_Panel_CN21.5 U11.6), [13] - TOP BOARD HEADER (CN25.23)
I2C1_SDA_TOP: [06] - TEMP, HUM, CUR SENSORS (10 pins), [07] - TEMP, PROXIMITY SENSORS (TP15.1 U9.1 U10.9), [08] - LUX, LED_BOARD CONN (CN20.2 LED_Panel_CN21.3 U11.5 U11.7), [13] - TOP BOARD HEADER (CN25.25)
INT_VCNL4200_TOP: [07] - TEMP, PROXIMITY SENSORS (R48.2 U10.8), [13] - TOP BOARD HEADER (CN25.18)
INT_VEML6030_TOP: [08] - LUX, LED_BOARD CONN (CN20.1 R51.2), [13] - TOP BOARD HEADER (CN26.20)
RESET_MB_TOP: [03] - RS232, JOYSTICK (CN5.1 R13.2), [13] - TOP BOARD HEADER (CN25.15)
TEC_A_TOP: [06] - TEMP, HUM, CUR SENSORS (R42.2 U8.12), [13] - TOP BOARD HEADER (CN25.9 CN25.10 CN25.11)
TEC_B_TOP: [06] - TEMP, HUM, CUR SENSORS (CN15.2), [13] - TOP BOARD HEADER (CN25.6 CN25.7 CN25.8)
USART1_RX_TOP: [03] - RS232, JOYSTICK (U4.9), [13] - TOP BOARD HEADER (CN25.14)
USART1_TX_TOP: [03] - RS232, JOYSTICK (U4.10), [13] - TOP BOARD HEADER (CN25.12)